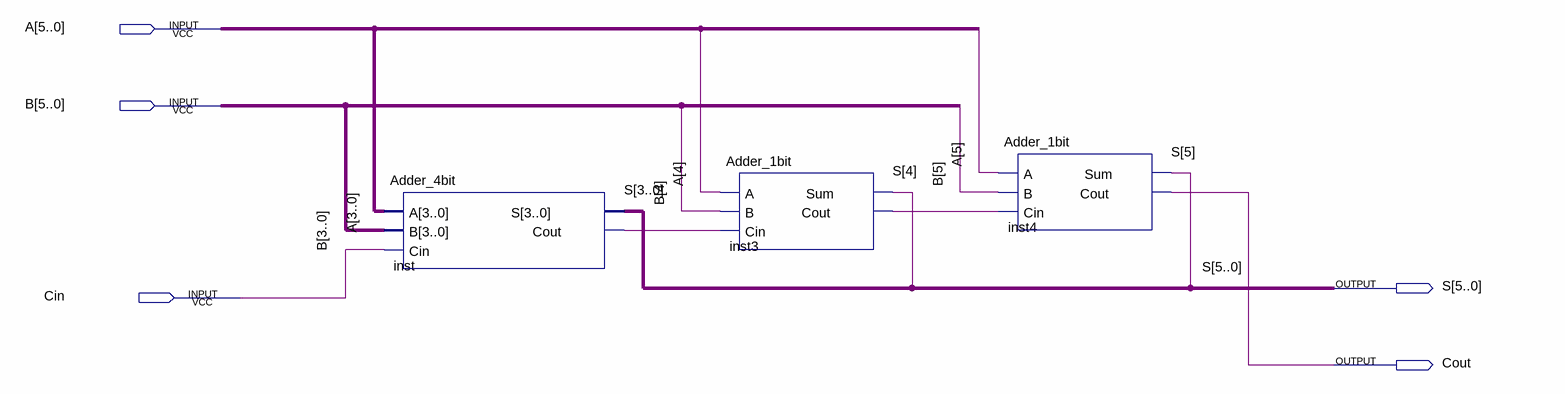
[diagram p0: schematic sheet]
// Quartus schematic Adder_6bit.bdf as structural Verilog: 3 symbols, 5 pins
module Adder_6bit (
  input  [5:0] A,
  input  [5:0] B,
  input  Cin,
  output [5:0] S,
  output Cout
);

  wire inst3_cout, inst_cout;

  Adder_4bit inst (.A(A[3:0]), .B(B[3:0]), .Cin(Cin), .S(S[3:0]), .Cout(inst_cout));
  Adder_1bit inst3 (.A(A[4]), .B(B[4]), .Cin(inst_cout), .Sum(S[4]), .Cout(inst3_cout));
  Adder_1bit inst4 (.A(A[5]), .B(B[5]), .Cin(inst3_cout), .Sum(S[5]), .Cout(Cout));
endmodule
